# Altium schematic sheet 2.NZPP.SchDoc
size 420 x 297 mm; SheetNumber: 2; SheetTotal: 2
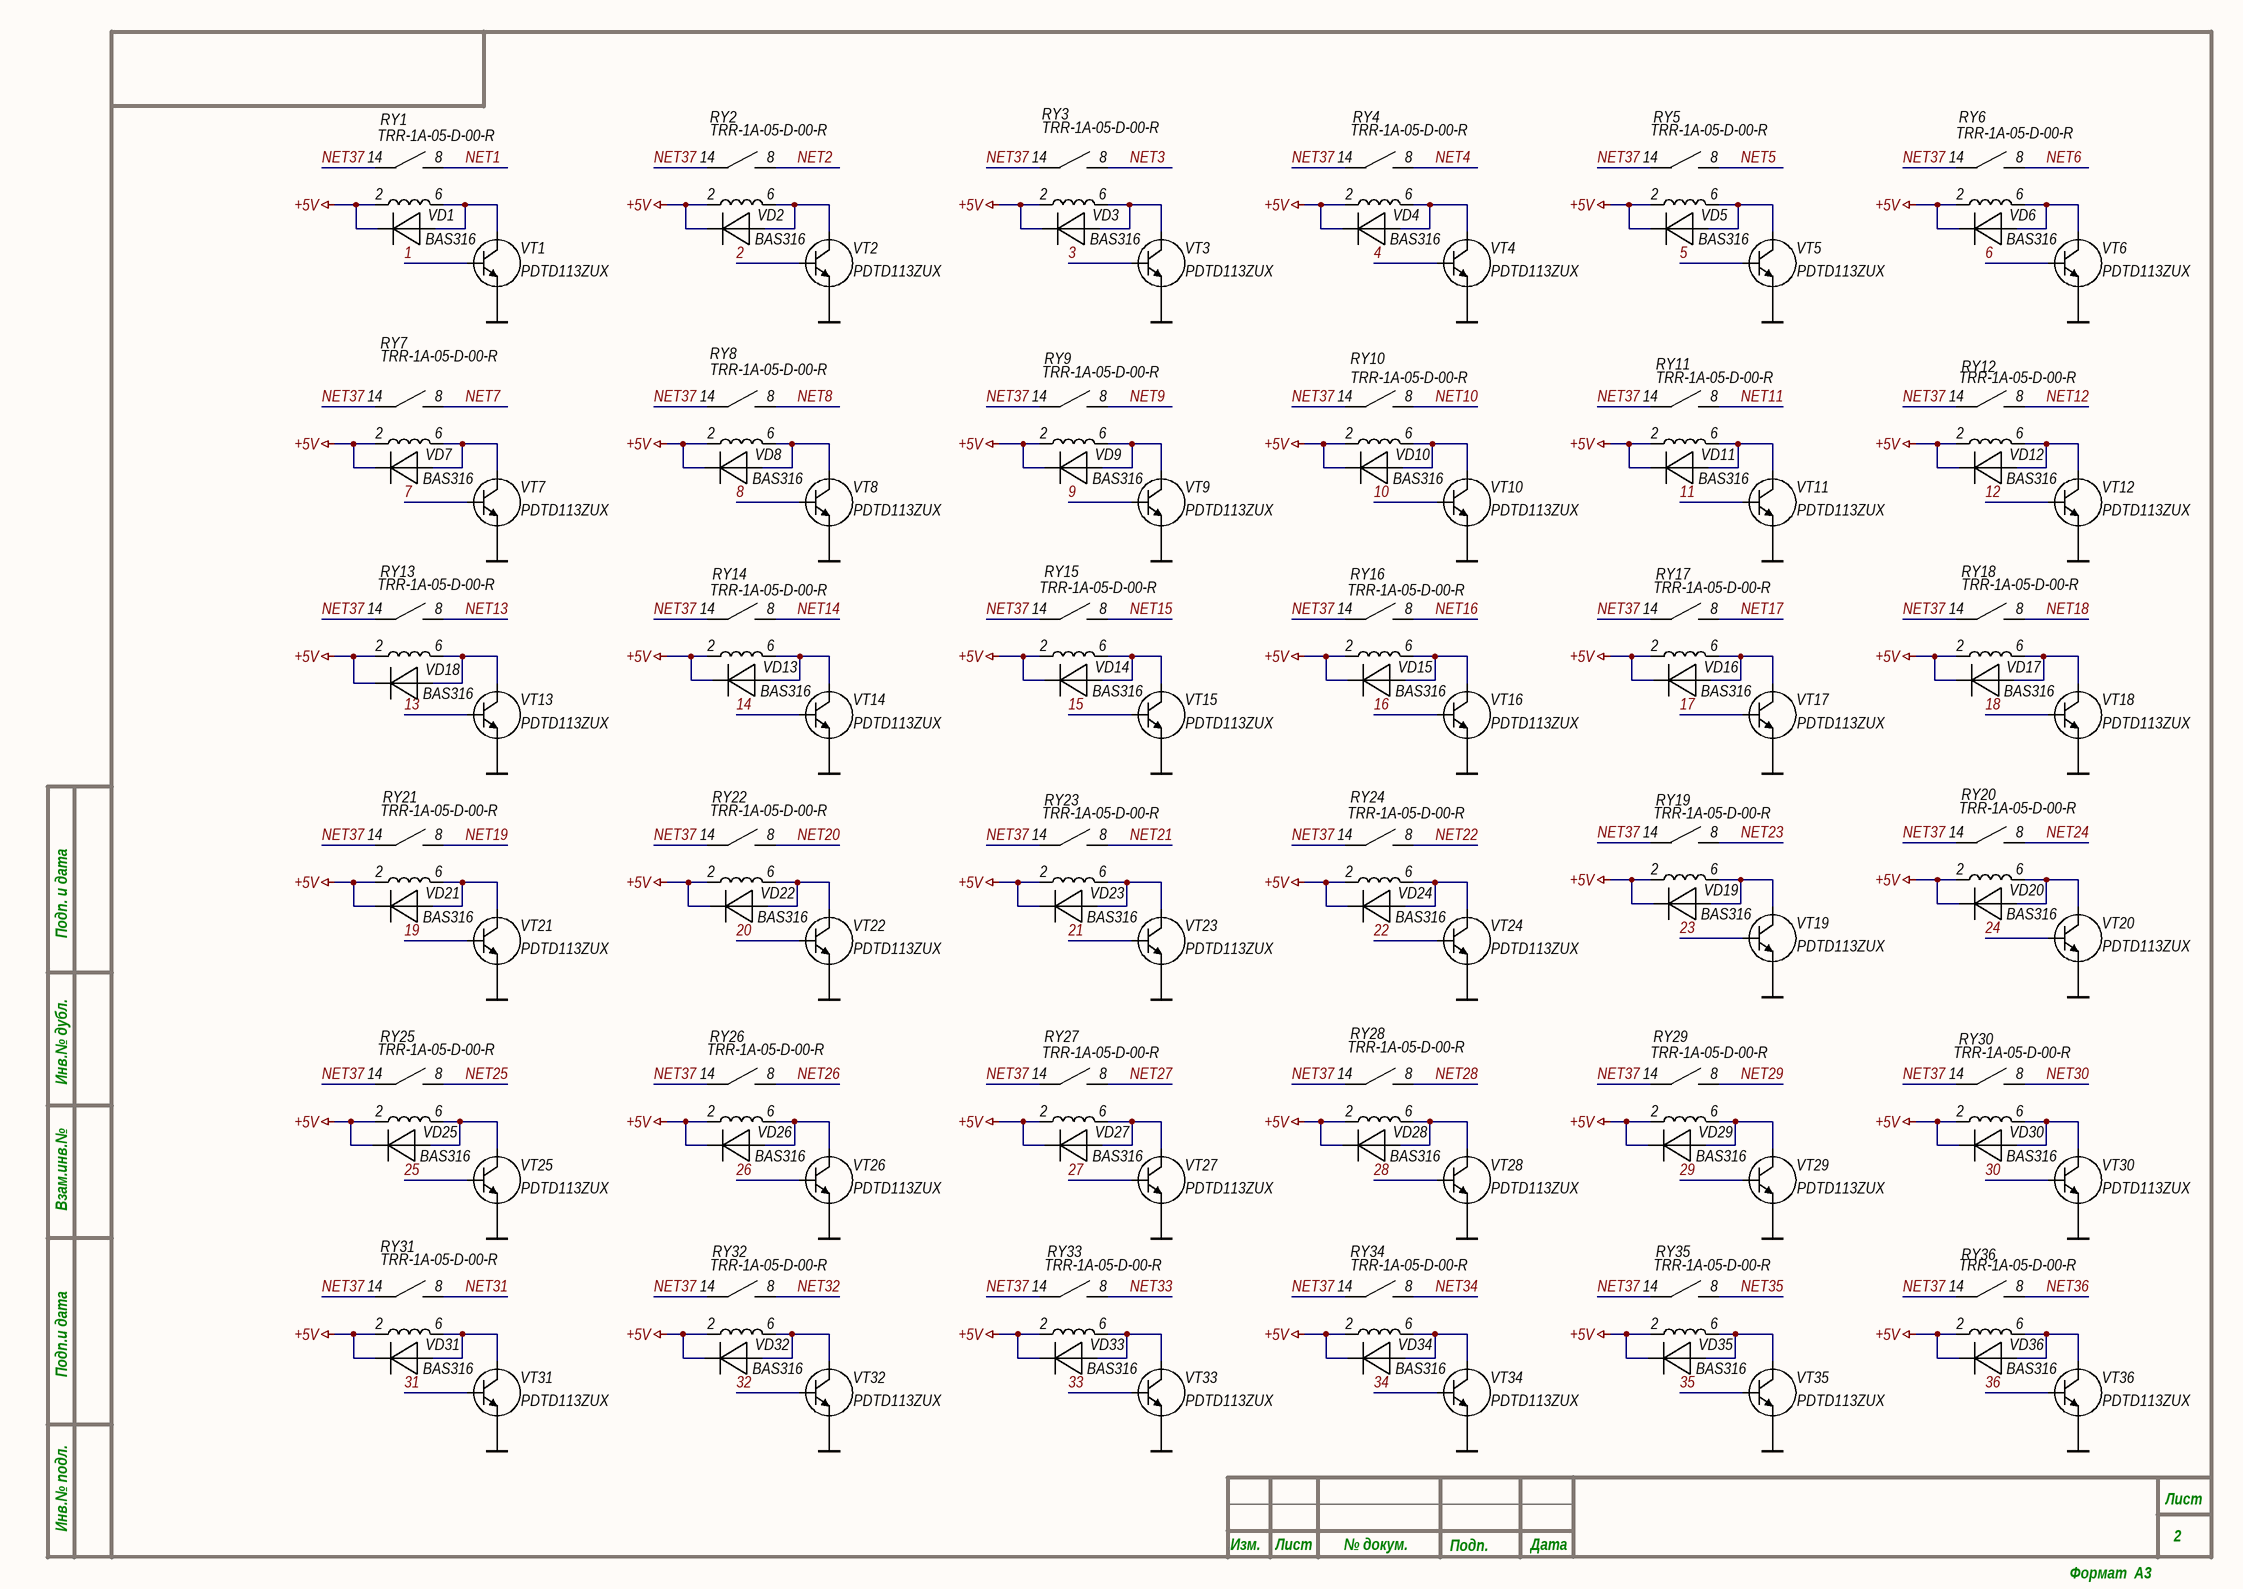
[diagram p0: 2.NZPP.SchDoc]

## Parts
RY1  TRR-1A-05-D-00-R  [TRR-1A-05-D-00-R]
RY2  TRR-1A-05-D-00-R  [TRR-1A-05-D-00-R]
RY3  TRR-1A-05-D-00-R  [TRR-1A-05-D-00-R]
RY4  TRR-1A-05-D-00-R  [TRR-1A-05-D-00-R]
RY5  TRR-1A-05-D-00-R  [TRR-1A-05-D-00-R]
RY6  TRR-1A-05-D-00-R  [TRR-1A-05-D-00-R]
RY7  TRR-1A-05-D-00-R  [TRR-1A-05-D-00-R]
RY8  TRR-1A-05-D-00-R  [TRR-1A-05-D-00-R]
RY9  TRR-1A-05-D-00-R  [TRR-1A-05-D-00-R]
RY10  TRR-1A-05-D-00-R  [TRR-1A-05-D-00-R]
RY11  TRR-1A-05-D-00-R  [TRR-1A-05-D-00-R]
RY12  TRR-1A-05-D-00-R  [TRR-1A-05-D-00-R]
RY13  TRR-1A-05-D-00-R  [TRR-1A-05-D-00-R]
RY14  TRR-1A-05-D-00-R  [TRR-1A-05-D-00-R]
RY15  TRR-1A-05-D-00-R  [TRR-1A-05-D-00-R]
RY16  TRR-1A-05-D-00-R  [TRR-1A-05-D-00-R]
RY17  TRR-1A-05-D-00-R  [TRR-1A-05-D-00-R]
RY18  TRR-1A-05-D-00-R  [TRR-1A-05-D-00-R]
RY19  TRR-1A-05-D-00-R  [TRR-1A-05-D-00-R]
RY20  TRR-1A-05-D-00-R  [TRR-1A-05-D-00-R]
RY21  TRR-1A-05-D-00-R  [TRR-1A-05-D-00-R]
RY22  TRR-1A-05-D-00-R  [TRR-1A-05-D-00-R]
RY23  TRR-1A-05-D-00-R  [TRR-1A-05-D-00-R]
RY24  TRR-1A-05-D-00-R  [TRR-1A-05-D-00-R]
RY25  TRR-1A-05-D-00-R  [TRR-1A-05-D-00-R]
RY26  TRR-1A-05-D-00-R  [TRR-1A-05-D-00-R]
RY27  TRR-1A-05-D-00-R  [TRR-1A-05-D-00-R]
RY28  TRR-1A-05-D-00-R  [TRR-1A-05-D-00-R]
RY29  TRR-1A-05-D-00-R  [TRR-1A-05-D-00-R]
RY30  TRR-1A-05-D-00-R  [TRR-1A-05-D-00-R]
RY31  TRR-1A-05-D-00-R  [TRR-1A-05-D-00-R]
RY32  TRR-1A-05-D-00-R  [TRR-1A-05-D-00-R]
RY33  TRR-1A-05-D-00-R  [TRR-1A-05-D-00-R]
RY34  TRR-1A-05-D-00-R  [TRR-1A-05-D-00-R]
RY35  TRR-1A-05-D-00-R  [TRR-1A-05-D-00-R]
RY36  TRR-1A-05-D-00-R  [TRR-1A-05-D-00-R]
VD1  BAS316  [DIODE: SOD323]
VD2  BAS316  [DIODE: SOD323]
VD3  BAS316  [DIODE: SOD323]
VD4  BAS316  [DIODE: SOD323]
VD5  BAS316  [DIODE: SOD323]
VD6  BAS316  [DIODE: SOD323]
VD7  BAS316  [DIODE: SOD323]
VD8  BAS316  [DIODE: SOD323]
VD9  BAS316  [DIODE: SOD323]
VD10  BAS316  [DIODE: SOD323]
VD11  BAS316  [DIODE: SOD323]
VD12  BAS316  [DIODE: SOD323]
VD13  BAS316  [DIODE: SOD323]
VD14  BAS316  [DIODE: SOD323]
VD15  BAS316  [DIODE: SOD323]
VD16  BAS316  [DIODE: SOD323]
VD17  BAS316  [DIODE: SOD323]
VD18  BAS316  [DIODE: SOD323]
VD19  BAS316  [DIODE: SOD323]
VD20  BAS316  [DIODE: SOD323]
VD21  BAS316  [DIODE: SOD323]
VD22  BAS316  [DIODE: SOD323]
VD23  BAS316  [DIODE: SOD323]
VD24  BAS316  [DIODE: SOD323]
VD25  BAS316  [DIODE: SOD323]
VD26  BAS316  [DIODE: SOD323]
VD27  BAS316  [DIODE: SOD323]
VD28  BAS316  [DIODE: SOD323]
VD29  BAS316  [DIODE: SOD323]
VD30  BAS316  [DIODE: SOD323]
VD31  BAS316  [DIODE: SOD323]
VD32  BAS316  [DIODE: SOD323]
VD33  BAS316  [DIODE: SOD323]
VD34  BAS316  [DIODE: SOD323]
VD35  BAS316  [DIODE: SOD323]
VD36  BAS316  [DIODE: SOD323]
VT1  PDTD113ZUX  [SC-70]
VT2  PDTD113ZUX  [SC-70]
VT3  PDTD113ZUX  [SC-70]
VT4  PDTD113ZUX  [SC-70]
VT5  PDTD113ZUX  [SC-70]
VT6  PDTD113ZUX  [SC-70]
VT7  PDTD113ZUX  [SC-70]
VT8  PDTD113ZUX  [SC-70]
VT9  PDTD113ZUX  [SC-70]
VT10  PDTD113ZUX  [SC-70]
VT11  PDTD113ZUX  [SC-70]
VT12  PDTD113ZUX  [SC-70]
VT13  PDTD113ZUX  [SC-70]
VT14  PDTD113ZUX  [SC-70]
VT15  PDTD113ZUX  [SC-70]
VT16  PDTD113ZUX  [SC-70]
VT17  PDTD113ZUX  [SC-70]
VT18  PDTD113ZUX  [SC-70]
VT19  PDTD113ZUX  [SC-70]
VT20  PDTD113ZUX  [SC-70]
VT21  PDTD113ZUX  [SC-70]
VT22  PDTD113ZUX  [SC-70]
VT23  PDTD113ZUX  [SC-70]
VT24  PDTD113ZUX  [SC-70]
VT25  PDTD113ZUX  [SC-70]
VT26  PDTD113ZUX  [SC-70]
VT27  PDTD113ZUX  [SC-70]
VT28  PDTD113ZUX  [SC-70]
VT29  PDTD113ZUX  [SC-70]
VT30  PDTD113ZUX  [SC-70]
VT31  PDTD113ZUX  [SC-70]
VT32  PDTD113ZUX  [SC-70]
VT33  PDTD113ZUX  [SC-70]
VT34  PDTD113ZUX  [SC-70]
VT35  PDTD113ZUX  [SC-70]
VT36  PDTD113ZUX  [SC-70]

## Nets
+5V: RY1.2 RY2.2 RY3.2 RY4.2 RY5.2 RY6.2 RY7.2 RY8.2 RY9.2 RY10.2 RY11.2 RY12.2 RY13.2 RY14.2 RY15.2 RY16.2 RY17.2 RY18.2 RY19.2 RY20.2 RY21.2 RY22.2 RY23.2 RY24.2 RY25.2 RY26.2 RY27.2 RY28.2 RY29.2 RY30.2 RY31.2 RY32.2 RY33.2 RY34.2 RY35.2 RY36.2 VD1.2 VD2.2 VD3.2 VD4.2 VD5.2 VD6.2 VD7.2 VD8.2 VD9.2 VD10.2 VD11.2 VD12.2 VD13.2 VD14.2 VD15.2 VD16.2 VD17.2 VD18.2 VD19.2 VD20.2 VD21.2 VD22.2 VD23.2 VD24.2 VD25.2 VD26.2 VD27.2 VD28.2 VD29.2 VD30.2 VD31.2 VD32.2 VD33.2 VD34.2 VD35.2 VD36.2
GND: VT1.2(E) VT2.2(E) VT3.2(E) VT4.2(E) VT5.2(E) VT6.2(E) VT7.2(E) VT8.2(E) VT9.2(E) VT10.2(E) VT11.2(E) VT12.2(E) VT13.2(E) VT14.2(E) VT15.2(E) VT16.2(E) VT17.2(E) VT18.2(E) VT19.2(E) VT20.2(E) VT21.2(E) VT22.2(E) VT23.2(E) VT24.2(E) VT25.2(E) VT26.2(E) VT27.2(E) VT28.2(E) VT29.2(E) VT30.2(E) VT31.2(E) VT32.2(E) VT33.2(E) VT34.2(E) VT35.2(E) VT36.2(E)
1: VT1.1(B)
2: VT2.1(B)
3: VT3.1(B)
4: VT4.1(B)
5: VT5.1(B)
6: VT6.1(B)
7: VT7.1(B)
8: VT8.1(B)
9: VT9.1(B)
10: VT10.1(B)
11: VT11.1(B)
12: VT12.1(B)
13: VT13.1(B)
14: VT14.1(B)
15: VT15.1(B)
16: VT16.1(B)
17: VT17.1(B)
18: VT18.1(B)
19: VT21.1(B)
20: VT22.1(B)
21: VT23.1(B)
22: VT24.1(B)
23: VT19.1(B)
24: VT20.1(B)
25: VT25.1(B)
26: VT26.1(B)
27: VT27.1(B)
28: VT28.1(B)
29: VT29.1(B)
30: VT30.1(B)
31: VT31.1(B)
32: VT32.1(B)
33: VT33.1(B)
34: VT34.1(B)
35: VT35.1(B)
36: VT36.1(B)
NET1: RY1.8
NET2: RY2.8
NET3: RY3.8
NET4: RY4.8
NET5: RY5.8
NET6: RY6.8
NET7: RY7.8
NET8: RY8.8
NET9: RY9.8
NET10: RY10.8
NET11: RY11.8
NET12: RY12.8
NET13: RY13.8
NET14: RY14.8
NET15: RY15.8
NET16: RY16.8
NET17: RY17.8
NET18: RY18.8
NET19: RY21.8
NET20: RY22.8
NET21: RY23.8
NET22: RY24.8
NET23: RY19.8
NET24: RY20.8
NET25: RY25.8
NET26: RY26.8
NET27: RY27.8
NET28: RY28.8
NET29: RY29.8
NET30: RY30.8
NET31: RY31.8
NET32: RY32.8
NET33: RY33.8
NET34: RY34.8
NET35: RY35.8
NET36: RY36.8
NET37: RY1.14 RY2.14 RY3.14 RY4.14 RY5.14 RY6.14 RY7.14 RY8.14 RY9.14 RY10.14 RY11.14 RY12.14 RY13.14 RY14.14 RY15.14 RY16.14 RY17.14 RY18.14 RY19.14 RY20.14 RY21.14 RY22.14 RY23.14 RY24.14 RY25.14 RY26.14 RY27.14 RY28.14 RY29.14 RY30.14 RY31.14 RY32.14 RY33.14 RY34.14 RY35.14 RY36.14
NetRY1_6: RY1.6 VD1.1 VT1.3(C)
NetRY2_6: RY2.6 VD2.1 VT2.3(C)
NetRY3_6: RY3.6 VD3.1 VT3.3(C)
NetRY4_6: RY4.6 VD4.1 VT4.3(C)
NetRY5_6: RY5.6 VD5.1 VT5.3(C)
NetRY6_6: RY6.6 VD6.1 VT6.3(C)
NetRY7_6: RY7.6 VD7.1 VT7.3(C)
NetRY8_6: RY8.6 VD8.1 VT8.3(C)
NetRY9_6: RY9.6 VD9.1 VT9.3(C)
NetRY10_6: RY10.6 VD10.1 VT10.3(C)
NetRY11_6: RY11.6 VD11.1 VT11.3(C)
NetRY12_6: RY12.6 VD12.1 VT12.3(C)
NetRY13_6: RY13.6 VD18.1 VT13.3(C)
NetRY14_6: RY14.6 VD13.1 VT14.3(C)
NetRY15_6: RY15.6 VD14.1 VT15.3(C)
NetRY16_6: RY16.6 VD15.1 VT16.3(C)
NetRY17_6: RY17.6 VD16.1 VT17.3(C)
NetRY18_6: RY18.6 VD17.1 VT18.3(C)
NetRY19_6: RY19.6 VD19.1 VT19.3(C)
NetRY20_6: RY20.6 VD20.1 VT20.3(C)
NetRY21_6: RY21.6 VD21.1 VT21.3(C)
NetRY22_6: RY22.6 VD22.1 VT22.3(C)
NetRY23_6: RY23.6 VD23.1 VT23.3(C)
NetRY24_6: RY24.6 VD24.1 VT24.3(C)
NetRY25_6: RY25.6 VD25.1 VT25.3(C)
NetRY26_6: RY26.6 VD26.1 VT26.3(C)
NetRY27_6: RY27.6 VD27.1 VT27.3(C)
NetRY28_6: RY28.6 VD28.1 VT28.3(C)
NetRY29_6: RY29.6 VD29.1 VT29.3(C)
NetRY30_6: RY30.6 VD30.1 VT30.3(C)
NetRY31_6: RY31.6 VD31.1 VT31.3(C)
NetRY32_6: RY32.6 VD32.1 VT32.3(C)
NetRY33_6: RY33.6 VD33.1 VT33.3(C)
NetRY34_6: RY34.6 VD34.1 VT34.3(C)
NetRY35_6: RY35.6 VD35.1 VT35.3(C)
NetRY36_6: RY36.6 VD36.1 VT36.3(C)

## Notes on the sheet
- Подп. и дата
- Инв.№ дубл.
- Взам.инв.№
- Подп.и дата
- Инв.№ подл.
- Изм.
- Лист
- № докум.
- Подп.
- Дата
- Формат  A3

## Library data of the parts
VD1-VD36 = Diode_single: Наименование: 1N4148; Примечание: SMD
VT1-VT36 = BJT_NPN_132: Manufacturer: ON Semiconductor; ValueManufacturerPartNumber: NPN transistor, 45V, 100mA, 100MHz, 300mW, 0.6V, 420, SOT-23, -55...+125°C; TypeTransistor: NPN transistor; VoltageCE: 45V; CurrentCE: 100mA; VoltageSaturation: 0.6V; Frequency: 100MHz; CurrentGain: 420; MaxPower: 300mW; Package: SOT-23; HelpURL: https://www.digikey.com/product-detail/en/on-semiconductor/BC847CLT1G/BC847CLT1GOSCT-ND/917836; Temperature: -55...+125°C; PartNumber: PDTD113ZUX